# Altium schematic sheet Reference_voltage.SchDoc: Reference voltage
size A4; Engineer: Matjaž Tome; Revision: B; SheetNumber: 9; SheetTotal: 10
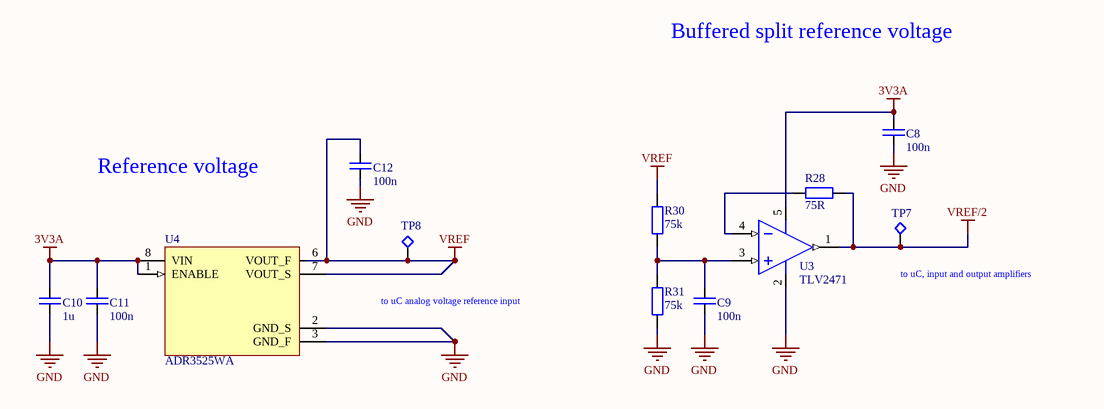
[diagram p0: Reference_voltage.SchDoc]

## Parts
C8  100n  [C_0603]
C9  100n  [C_0603]
C10  1u  [C_0603]
C11  100n  [C_0603]
C12  100n  [C_0603]
R28  75R  [R_0603]
R30  75k  [R_0603]
R31  75k  [R_0603]
TP7  testpoint  [TP1_FULL]  (value not drawn)
TP8  testpoint  [TP1_FULL]  (value not drawn)
U3  TLV2471  [SOT23-5]
U4  ADR3525WA  [MSOP8]

## Nets
3V3A: C8.2 C10.1 C11.1 U3.5(V+) U4.1(ENABLE) U4.8(VIN)
GND: C8.1 C9.2 C10.2 C11.2 C12.2 R31.1 U3.2(V-) U4.2(GND_S) U4.3(GND_F)
VREF: C12.1 R30.2 TP8.1 U4.6(VOUT_F) U4.7(VOUT_S)
VREF/2: R28.2 TP7.1 U3.1(OUT_A)
NetC9_1: C9.1 R30.1 R31.2 U3.3(+IN_A)
NetR28_1: R28.1 U3.4(-IN_A)

## Notes on the sheet
- Buffered split reference voltage
- Reference voltage
- (near TP7) to uC, input and output amplifiers
- (near TP8) to uC analog voltage reference input

## Library data of the parts
C8-C12 = Capacitor: Generic capacitor
  C8 C9 C11 C12: Value: 100n
  C10: Value: 1u
R28 R30 R31 = Resistor: Generic resistor
  R28: Value: 75R
  R30 R31: Value: 75k
TP7 TP8 = Test Point: testpoint 1.5mm diameter no hole; Part Number: XXC0006; Category: testpoints
U3 = TLV2471: FAMILY OF 600μA/Ch 2.8MHz RAIL-TO-RAIL INPUT/OUTPUT / HIGH-DRIVE OPERATIONAL AMPLIFIERS WITH SHUTDOWN; Part Number: XOG0002; Manufacturer: Texas Instruments; Manufacturer Number: TLV2471IDBVT; Dealer number: 1102964; Dealer: Farnell; Supply voltage max: 6V; Supply voltage min: 2.7V; Devices: 1; Rail to Rail: IN/OUT; Category: Integrated circuits; Price: 1.43; GBP: 2.8MHz; Case: SOT23-5; Technology: SMT; HelpURL: http://www.ti.com/general/docs/suppproductinfo.tsp?distId=26&gotoUrl=http%3A%2F%2Fwww.ti.com%2Flit%2Fgpn%2Ftlv2471
U4 = ADR3525W: Micropower, High Accuracy / Voltage References; Part Number: VRX0002; Manufacturer: Analog devices; Manufacturer Number: ADR3525WARMZ-R7; Dealer number: 2077701; Dealer: Farnell; Output Voltage: 2.5V; Max input voltage: 5.5V; Output current: 10mA; Voltage tolerance: 0.1%; Category: Integrated circuits; Price: 1.66; Case: MSOP8; Technology: SMT; HelpURL: https://www.farnell.com/datasheets/1511785.pdf